# Altium schematic sheet Connect.SchDoc
size A4; SheetNumber: 3; SheetTotal: 3
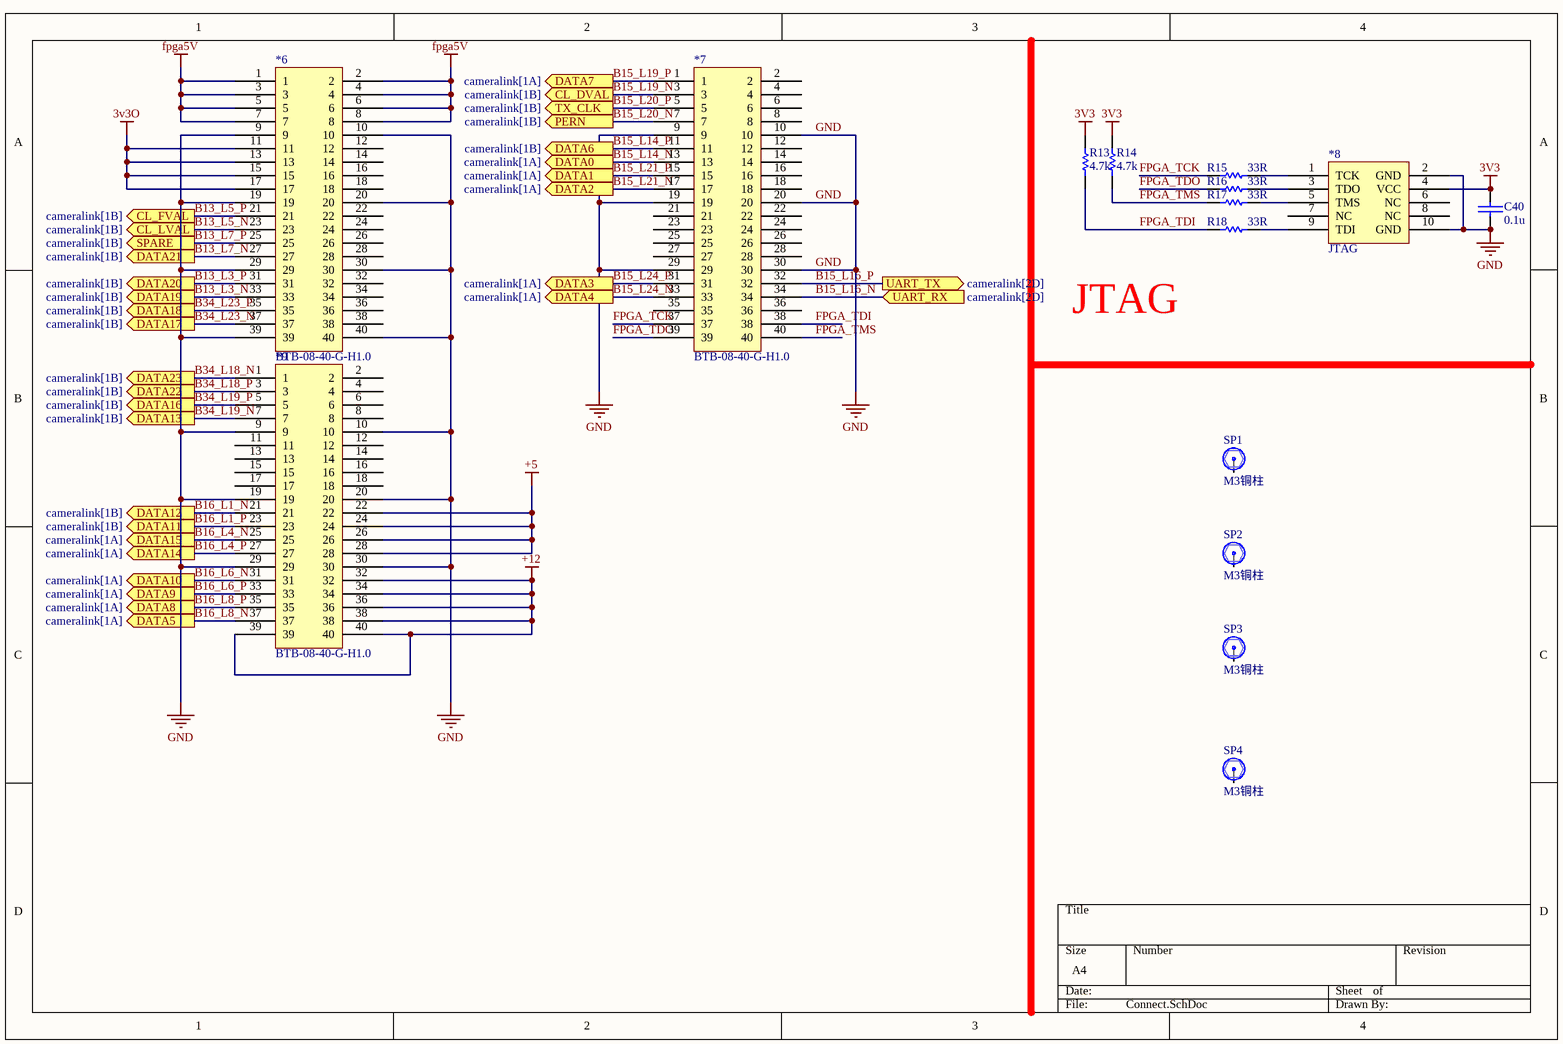
[diagram p0: Connect.SchDoc]

## Parts
*6  BTB-08-40-G-H1.0  [BTB-08-40-M-H1.0]
*7  BTB-08-40-G-H1.0  [BTB-08-40-M-H1.0]
*8  JTAG  [JTAG]
*9  BTB-08-40-G-H1.0  [BTB-08-40-M-H1.0]
C40  0.1u  [0603C]
R13  4.7k  [0603R]
R14  4.7k  [0603R]
R15  33R  [0603R]
R16  33R  [0603R]
R17  33R  [0603R]
R18  33R  [0603R]
SP1  M3铜柱  [M3x4_N]
SP2  M3铜柱  [M3x4_N]
SP3  M3铜柱  [M3x4_N]
SP4  M3铜柱  [M3x4_N]

## Ports
CL_DVAL (out, see cameralink[1B]), CL_FVAL (out, see cameralink[1B]), CL_LVAL (out, see cameralink[1B]), DATA0 (out, see cameralink[1A]), DATA1 (out, see cameralink[1A]), DATA2 (out, see cameralink[1A]), DATA3 (out, see cameralink[1A]), DATA4 (out, see cameralink[1A]), DATA5 (out, see cameralink[1A]), DATA6 (out, see cameralink[1B]), DATA7 (out, see cameralink[1A]), DATA8 (out, see cameralink[1A]), DATA9 (out, see cameralink[1A]), DATA10 (out, see cameralink[1A]), DATA11 (out, see cameralink[1B]), DATA12 (out, see cameralink[1B]), DATA13 (out, see cameralink[1B]), DATA14 (out, see cameralink[1A]), DATA15 (out, see cameralink[1A]), DATA16 (out, see cameralink[1B]), DATA17 (out, see cameralink[1B]), DATA18 (out, see cameralink[1B]), DATA19 (out, see cameralink[1B]), DATA20 (out, see cameralink[1B]), DATA21 (out, see cameralink[1B]), DATA22 (out, see cameralink[1B]), DATA23 (out, see cameralink[1B]), PERN (out, see cameralink[1B]), SPARE (out, see cameralink[1B]), TX_CLK (out, see cameralink[1B]), UART_RX (in, see cameralink[2D]), UART_TX (out, see cameralink[2D])

## Nets
3V3: *8.4(VCC) C40.2 R13.2 R14.2
3v3O: *6.11 *6.13 *6.15 *6.17
+5: *9.22 *9.24 *9.26 *9.28
+12: *9.32 *9.34 *9.36 *9.38 *9.39 *9.40
fpga5V: *6.1 *6.2 *6.3 *6.4 *6.5 *6.6 *6.7 *6.8
GND: *6.9 *6.10 *6.19 *6.20 *6.29 *6.30 *6.39 *6.40 *7.9 *7.10 *7.19 *7.20 *7.29 *7.30 *8.2(GND) *8.10(GND) *9.9 *9.10 *9.19 *9.20 *9.29 *9.30 C40.1
B13_L3_N: *6.33 ; port DATA19
B13_L3_P: *6.31 ; port DATA20
B13_L5_N: *6.23 ; port CL_LVAL
B13_L5_P: *6.21 ; port CL_FVAL
B13_L7_N: *6.27 ; port DATA21
B13_L7_P: *6.25 ; port SPARE
B15_L14_N: *7.13 ; port DATA0
B15_L14_P: *7.11 ; port DATA6
B15_L16_N: *7.34 ; port UART_RX
B15_L16_P: *7.32 ; port UART_TX
B15_L19_N: *7.3 ; port CL_DVAL
B15_L19_P: *7.1 ; port DATA7
B15_L20_N: *7.7 ; port PERN
B15_L20_P: *7.5 ; port TX_CLK
B15_L21_N: *7.17 ; port DATA2
B15_L21_P: *7.15 ; port DATA1
B15_L24_N: *7.33 ; port DATA4
B15_L24_P: *7.31 ; port DATA3
B16_L1_N: *9.21 ; port DATA12
B16_L1_P: *9.23 ; port DATA11
B16_L4_N: *9.25 ; port DATA15
B16_L4_P: *9.27 ; port DATA14
B16_L6_N: *9.31 ; port DATA10
B16_L6_P: *9.33 ; port DATA9
B16_L8_N: *9.37 ; port DATA5
B16_L8_P: *9.35 ; port DATA8
B34_L18_N: *9.1 ; port DATA23
B34_L18_P: *9.3 ; port DATA22
B34_L19_N: *9.7 ; port DATA13
B34_L19_P: *9.5 ; port DATA16
B34_L23_N: *6.37 ; port DATA17
B34_L23_P: *6.35 ; port DATA18
FPGA_TCK: *7.37 R15.1
FPGA_TDI: *7.38 R13.1 R18.1
FPGA_TDO: *7.39 R16.1
FPGA_TMS: *7.40 R14.1 R17.1
Net*8_1: *8.1(TCK) R15.2
Net*8_3: *8.3(TDO) R16.2
Net*8_5: *8.5(TMS) R17.2
Net*8_9: *8.9(TDI) R18.2

Not connected (* = marked no-connect by the designer): *6 12 14 16 18 22 24 26 28 32 34 36 38; *7 2 4 6 8 12 14 16 18 21 22 23 24 25 26 27 28 35 36; *8 6(NC) 7(NC) 8(NC); *9 2 4 6 8 11 12 13 14 15 16 17 18; SP1 1; SP2 1; SP3 1; SP4 1

## Notes on the sheet
- JTAG

## Library data of the parts
C40 = CAP: 无极性电容
R13-R18 = RES: 电阻
SP1-SP4 = 铜柱大焊盘: 铜柱; 版权归属: 封装库来自淘宝 ID：黄晶宝石; BOM名称: 铜柱; 学习资源: https://shop463601444.taobao.com